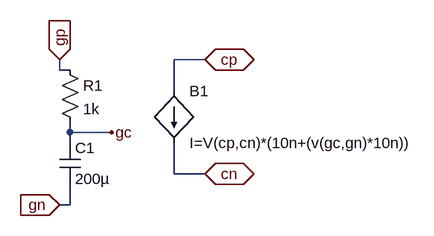
[diagram p0: schematic gas_sensor.asc]
gas_sensor.asc, the LTspice schematic file:
Version 4
SHEET 1 880 680
WIRE 288 80 240 80
WIRE 64 96 64 80
WIRE 80 96 64 96
WIRE 240 128 240 80
WIRE 80 192 80 176
WIRE 144 192 80 192
WIRE 80 208 80 192
WIRE 240 256 240 208
WIRE 288 256 240 256
WIRE 80 304 80 272
WIRE 80 304 64 304
FLAG 64 80 gp
IOPIN 64 80 In
FLAG 64 304 gn
IOPIN 64 304 In
FLAG 288 80 cp
IOPIN 288 80 BiDir
FLAG 288 256 cn
IOPIN 288 256 BiDir
FLAG 144 192 gc
SYMBOL cap 64 208 R0
SYMATTR InstName C1
SYMATTR Value 200µ
SYMBOL res 64 80 R0
SYMATTR InstName R1
SYMATTR Value 1k
SYMBOL bi 240 128 R0
SYMATTR InstName B1
SYMATTR Value I=V(cp,cn)*(10n+(v(gc,gn)*10n))

The netlist it stands for:
* gas_sensor.asc
C1 gc gn 200µ
R1 gp gc 1k
B1 cp cn I=V(cp,cn)*(10n+(v(gc,gn)*10n))
.backanno
.end